# Altium schematic sheet BMS Slave V0.1.SchDoc
size A4; SheetNumber: 1; SheetTotal: 9
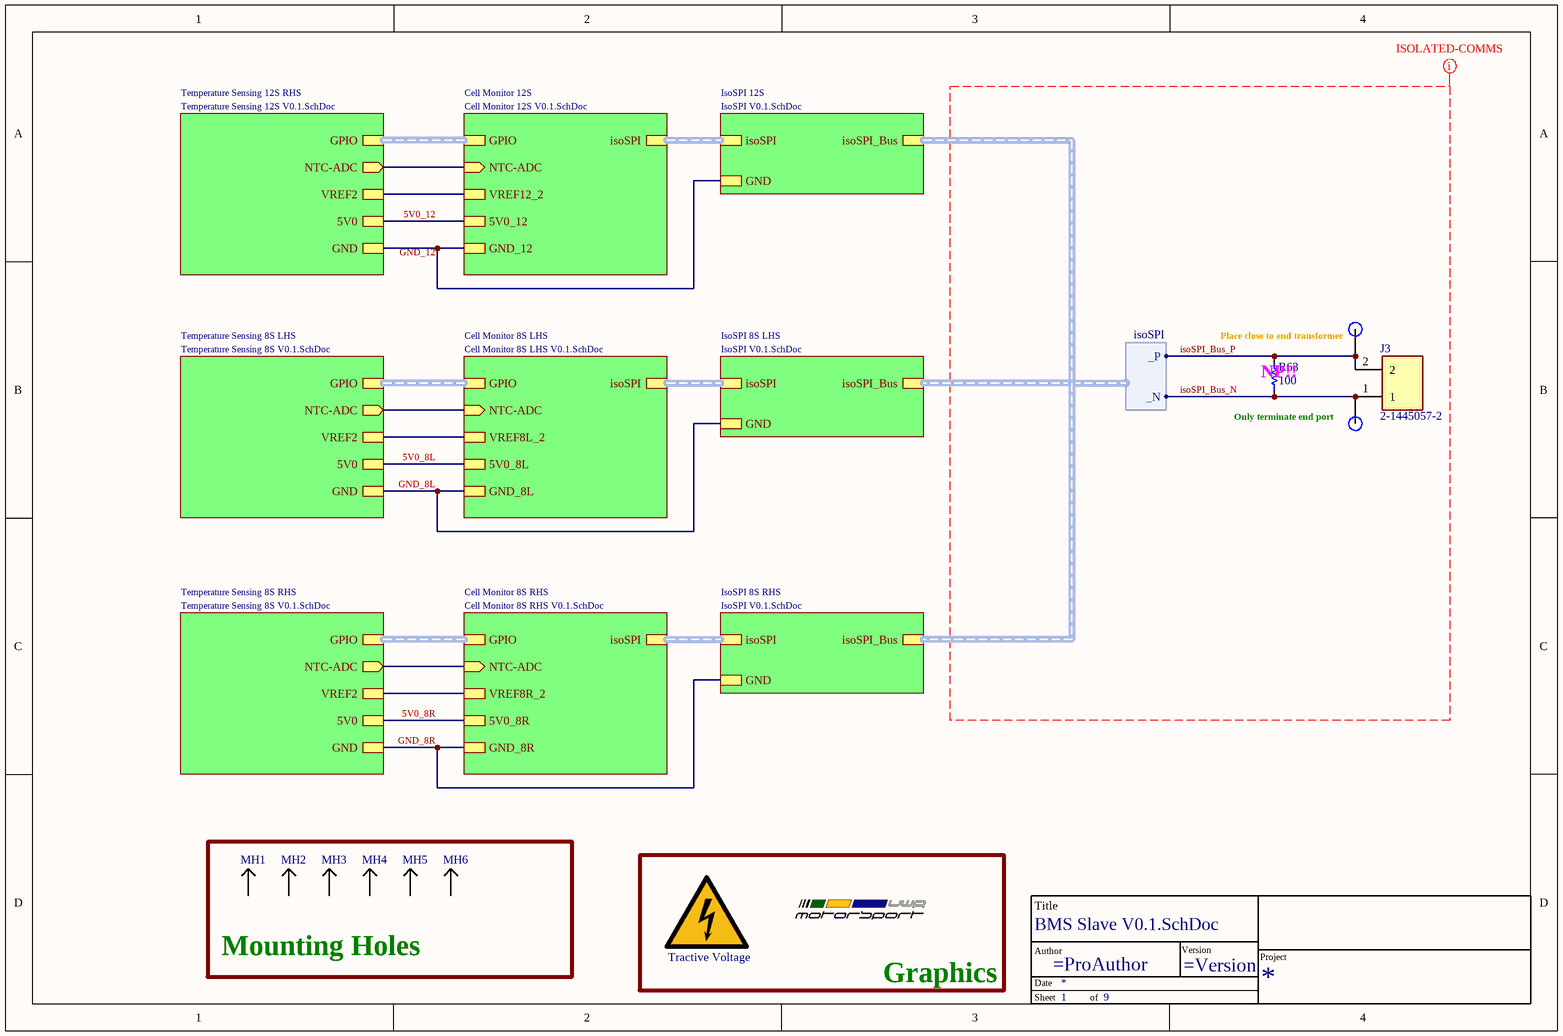
[diagram p0: BMS Slave V0.1.SchDoc]

## Parts
(Parts that share a designator on the sheet are numbered #1, #2 ... from top to bottom, then left to right.)
*#1  UWAM Logo  [UWAM Logo]  (value not drawn)  (graphical)
*#2  TitleBlock  (value not drawn)  (graphical)
aaa1  Tractive voltage symbol  [Tractive voltage]  (value not drawn)  (no BOM)
J3  2-1445057-2  [TE_2-1445057-2]
MH1  M3 Mounting Hole  [M3 MH]  (value not drawn)  (no BOM)
MH2  M3 Mounting Hole  [M3 MH]  (value not drawn)  (no BOM)
MH3  M3 Mounting Hole  [M3 MH]  (value not drawn)  (no BOM)
MH4  M3 Mounting Hole  [M3 MH]  (value not drawn)  (no BOM)
MH5  M3 Mounting Hole  [M3 MH]  (value not drawn)  (no BOM)
MH6  M3 Mounting Hole  [M3 MH]  (value not drawn)  (no BOM)
R63  value 100  [R_0402]  (hidden comment: RC0402FR-07100RL)
TP6  IPA  [Test Point]  (value not drawn)  (no BOM)
TP7  IMA  [Test Point]  (value not drawn)  (no BOM)

## Blocks framed on the sheet
Mounting Holes: MH1-MH6
Graphics: *#1 aaa1

## Sub-sheets
Cell Monitor 8S LHS = Cell Monitor 8S LHS V0.1.SchDoc: GPIO (harness GPIO), isoSPI (harness isoSPI), VREF8L_2, NTC-ADC (in), 5V0_8L, GND_8L
Cell Monitor 8S RHS = Cell Monitor 8S RHS V0.1.SchDoc: GPIO (harness GPIO), isoSPI (harness isoSPI), VREF8R_2, NTC-ADC (in), 5V0_8R, GND_8R
Cell Monitor 12S = Cell Monitor 12S V0.1.SchDoc: GPIO (harness GPIO), isoSPI (harness isoSPI), VREF12_2, NTC-ADC (in), 5V0_12, GND_12
IsoSPI 8S LHS = IsoSPI V0.1.SchDoc: isoSPI (harness isoSPI), isoSPI_Bus (harness isoSPI), GND
IsoSPI 8S RHS = IsoSPI V0.1.SchDoc: isoSPI (harness isoSPI), isoSPI_Bus (harness isoSPI), GND
IsoSPI 12S = IsoSPI V0.1.SchDoc: isoSPI (harness isoSPI), isoSPI_Bus (harness isoSPI), GND
Temperature Sensing 8S LHS = Temperature Sensing 8S V0.1.SchDoc: GPIO (harness GPIO), NTC-ADC (out), VREF2, 5V0, GND
Temperature Sensing 8S RHS = Temperature Sensing 8S V0.1.SchDoc: GPIO (harness GPIO), NTC-ADC (out), VREF2, 5V0, GND
Temperature Sensing 12S RHS = Temperature Sensing 12S V0.1.SchDoc: GPIO (harness GPIO), NTC-ADC (out), VREF2, 5V0, GND

## Harnesses
isoSPI: _P, _N

## Nets
5V0_8L: sheet Cell Monitor 8S LHS/5V0_8L, sheet Temperature Sensing 8S LHS/5V0
5V0_8R: sheet Cell Monitor 8S RHS/5V0_8R, sheet Temperature Sensing 8S RHS/5V0
5V0_12: sheet Cell Monitor 12S/5V0_12, sheet Temperature Sensing 12S RHS/5V0
GND_8L: sheet Cell Monitor 8S LHS/GND_8L, sheet Temperature Sensing 8S LHS/GND, sheet IsoSPI 8S LHS/GND
GND_8R: sheet Cell Monitor 8S RHS/GND_8R, sheet Temperature Sensing 8S RHS/GND, sheet IsoSPI 8S RHS/GND
GND_12: sheet Cell Monitor 12S/GND_12, sheet IsoSPI 12S/GND, sheet Temperature Sensing 12S RHS/GND
isoSPI_Bus_N: J3.1 R63.1 TP7.1 ; sheet IsoSPI 12S/isoSPI_Bus._N
isoSPI_Bus_P: J3.2 R63.2 TP6.1 ; sheet IsoSPI 12S/isoSPI_Bus._P
(unnamed): sheet Cell Monitor 12S/VREF12_2, sheet Temperature Sensing 12S RHS/VREF2
(unnamed): sheet Cell Monitor 12S/NTC-ADC, sheet Temperature Sensing 12S RHS/NTC-ADC
(unnamed): sheet Cell Monitor 8S LHS/VREF8L_2, sheet Temperature Sensing 8S LHS/VREF2
(unnamed): sheet Cell Monitor 8S LHS/NTC-ADC, sheet Temperature Sensing 8S LHS/NTC-ADC
(unnamed): sheet Cell Monitor 8S RHS/VREF8R_2, sheet Temperature Sensing 8S RHS/VREF2
(unnamed): sheet Cell Monitor 8S RHS/NTC-ADC, sheet Temperature Sensing 8S RHS/NTC-ADC

Not connected (* = marked no-connect by the designer): MH1 1; MH2 1; MH3 1; MH4 1; MH5 1; MH6 1

## Buses and harness runs
harness sheet Cell Monitor 8S LHS/GPIO = sheet Temperature Sensing 8S LHS/GPIO
harness sheet Cell Monitor 8S LHS/isoSPI = sheet IsoSPI 8S LHS/isoSPI
harness sheet Cell Monitor 8S RHS/GPIO = sheet Temperature Sensing 8S RHS/GPIO
harness sheet Cell Monitor 8S RHS/isoSPI = sheet IsoSPI 8S RHS/isoSPI
harness sheet Cell Monitor 12S/GPIO = sheet Temperature Sensing 12S RHS/GPIO
harness sheet Cell Monitor 12S/isoSPI = sheet IsoSPI 12S/isoSPI
harness sheet IsoSPI 8S LHS/isoSPI_Bus = sheet IsoSPI 8S RHS/isoSPI_Bus = sheet IsoSPI 12S/isoSPI_Bus

## Layout directives
net class IsoComms: isoSPI_Bus_N, isoSPI_Bus_P

## Notes on the sheet
- (near TP6) Place close to end transformer
- (near R63) NP!!
- Only terminate end port
- (in symbol TitleBlock) Title; Author; Version; Project; Date; Sheet; of
- (in symbol Tractive voltage symbol) Tractive Voltage

## Library data of the parts
J3 = 2-1445057-2: CONN HEADER 3MM 2POS R/A TIN SMD; Manufacturer 1: TE Connectivity; MF: {'manufacturer': u'TE Connectivity'}; Package: None; MP: 2-1445057-2; Availability: Unavailable; Price: None; Supplier 1: Mouser; Supplier Part Number 1: 571-2-1445057-2; Manufacturer Part Number 1: 2-1445057-2
R63 = Resistor
TP6 TP7 = Test Point: 1.2mm Test point